# Altium project PMI_MotorDriver.PrjPCB
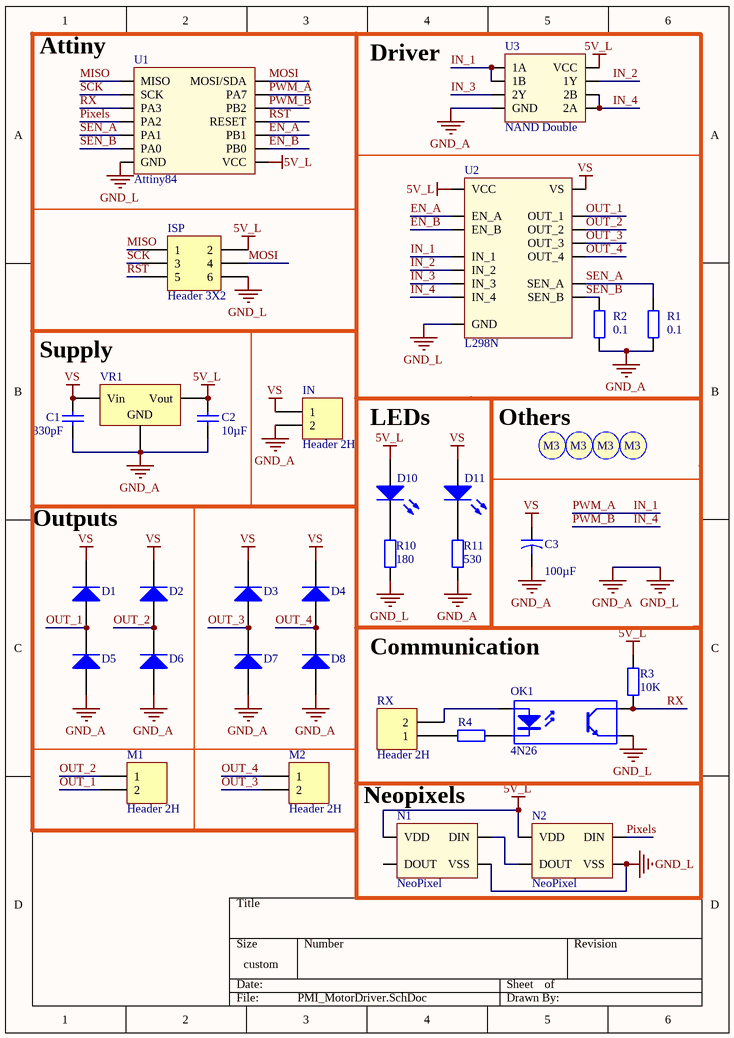
[diagram p0: PMI_MotorDriver.SchDoc]
1 sheet, 35 parts. Net scope: global (net labels, ports and power ports of the same name join across sheets).
Board file: PMI_MotorDriver.PcbDoc

## Sheet PMI_MotorDriver.SchDoc: PMI Motor Driver
size 136 x 193 mm; Date: 04/05/2019; DrawnBy: Damien DESCLAUX; Engineer: Damien DESCLAUX; Organization: Supaero Robotik Club; DocumentNumber: 1; Revision: V 1.0; CurrentTime: 11H00; CurrentDate: 04/05/2019; DocumentName: PMI_MotorDriver

### Parts
C1  value 330pF  [3.2X1.6X1.1]  (hidden comment: Cap)
C2  value 10µF  [3.2X1.6X1.1]  (hidden comment: Cap)
C3  value 100µF  [Condensateur]  (hidden comment: Cap2)
D1  GF1G-E3/5CA (710-2976)  [DO-214BA]  (value not drawn)
D2  Diode  [DO-214BA]  (value not drawn)
D3  Diode  [DO-214BA]  (value not drawn)
D4  Diode  [DO-214BA]  (value not drawn)
D5  Diode  [DO-214BA]  (value not drawn)
D6  Diode  [DO-214BA]  (value not drawn)
D7  Diode  [DO-214BA]  (value not drawn)
D8  Diode  [DO-214BA]  (value not drawn)
D10  LED2  [3.2X1.6X1.1]  (value not drawn)
D11  LED2  [3.2X1.6X1.1]  (value not drawn)
IN  Header 2H  [Molex SPOX 2x1H]
ISP  Header 3X2  [HDR2X3]
M1  Header 2H  [Molex SPOX 2x1H]
M2  Header 2H  [Molex SPOX 2x1H]
N1  NeoPixel  [Neopixel]
N2  NeoPixel  [Neopixel]
OK1  4N26  [4N26]
R1  value 0.1  [CRA2512]  (hidden comment: Res2)
R2  value 0.1  [CRA2512]  (hidden comment: Res2)
R3  value 10K  [3.2X1.6X1.1]  (hidden comment: Res2)
R4  Res2  [3.2X1.6X1.1]  (value not drawn)
R10  value 180  [3.2X1.6X1.1]  (hidden comment: Res2)
R11  value 530  [3.2X1.6X1.1]  (hidden comment: Res2)
RX  Header 2H  [Molex SPOX 2x1H]
S1  Screw M3  [Screw M3]  (value not drawn)
S2  Screw M3  [Screw M3]  (value not drawn)
S3  Screw M3  [Screw M3]  (value not drawn)
S4  Screw M3  [Screw M3]  (value not drawn)
U1  Attiny84  [Attiny84 SOIC]
U2  L298N  [L298N]
U3  NAND Double  [SOIC_8]
VR1  BA178M05FP-E2  [TO-252]  (value not drawn)

### Nets
5V_L: C2.2 D10.1(A) ISP.2 N1.4(VDD) N2.4(VDD) R3.2 U1.1(VCC) U2.9(VCC) U3.8(VCC) VR1.3(Vout)
GND_A: C1.1 C2.1 C3.2 D5.1(A) D6.1(A) D7.1(A) D8.1(A) IN.2 ISP.6 N1.2(VSS) N2.2(VSS) OK1.3(E) R1.1 R2.1 R10.2 R11.2 U1.14(GND) U2.8(GND) U3.4(GND) VR1.2(GND)  [also labelled GND_L]
VS: C1.2 C3.1 D1.2(K) D2.2(K) D3.2(K) D4.2(K) D11.1(A) IN.1 U2.4(VS) VR1.1(Vin)
EN_A: U1.3(PB1) U2.6(EN_A)
EN_B: U1.2(PB0) U2.11(EN_B)
IN_1: U1.6(PA7) U2.5(IN_1) U3.1(1A) U3.2(1B)  [also labelled PWM_A]
IN_2: U2.7(IN_2) U3.7(1Y)
IN_3: U2.10(IN_3) U3.3(2Y)
IN_4: U1.5(PB2) U2.12(IN_4) U3.5(2A) U3.6(2B)  [also labelled PWM_B]
MISO: ISP.1 U1.8(MISO)
MOSI: ISP.4 U1.7(MOSI/SDA)
OUT_1: D1.1(A) D5.2(K) M1.2 U2.2(OUT_1)
OUT_2: D2.1(A) D6.2(K) M1.1 U2.3(OUT_2)
OUT_3: D3.1(A) D7.2(K) M2.2 U2.13(OUT_3)
OUT_4: D4.1(A) D8.2(K) M2.1 U2.14(OUT_4)
Pixels: N2.3(DIN) U1.11(PA2)
RST: ISP.5 U1.4(RESET)
RX: OK1.4(C) R3.1 U1.10(PA3)
SCK: ISP.3 U1.9(SCK)
SEN_A: R1.2 U1.12(PA1) U2.1(SEN_A)
SEN_B: R2.2 U1.13(PA0) U2.15(SEN_B)
NetD10_2: D10.2(K) R10.1
NetD11_2: D11.2(K) R11.1
NetN1_3: N1.3(DIN) N2.1(DOUT)
NetOK1_1: OK1.1(A) RX.2
NetOK1_2: OK1.2(K) R4.2
NetR4_1: R4.1 RX.1

Not connected (* = marked no-connect by the designer): N1 1(DOUT)

### Notes on the sheet
- (near U1) Attiny
- Driver
- Supply
- LEDs
- Others
- Outputs
- Communication
- (near N1) Neopixels
- (in symbol Screw M3) M3

### Library data of the parts
C1 C2 = Cap: Capacitor; Published: 8-Jun-2000; LatestRevisionDate: 17-Jul-2002; LatestRevisionNote: Re-released for DXP Platform.; PackageReference: RAD-0.3; Publisher: Altium Limited; PackageDescription: Radial Cap, Thru-Hole; 2 Leads; 0.3 in Pin Spacing
C3 = Cap2: Capacitor; Published: 23-Sep-2002; PackageReference: CAPR5-4X5; Publisher: Altium Limited; PackageDescription: Capacitor; 2 Leads
D1-D8 = Diode: Default Diode; Published: 8-Jun-2000; LatestRevisionDate: 17-Jul-2002; LatestRevisionNote: Re-released for DXP Platform.; PackageVersion: Sep-1996; PackageReference: SMC; Publisher: Altium Limited; PackageDescription: DO-214-AB/SMC; 2 C-Bend Leads; Body 7.9 x 5.9 mm, inc. leads (LxW); Code_JEDEC: DO-214-AB
D10 D11 = LED2: Typical RED, GREEN, YELLOW, AMBER GaAs LED; Published: 8-Jun-2000; LatestRevisionDate: 17-Jul-2002; LatestRevisionNote: Re-released for DXP Platform.; PackageVersion: Feb-2002; PackageReference: 3.2X1.6X1.1; Publisher: Altium Limited; PackageDescription: SM LED; 2 Flat Leads
IN M1 M2 RX = Header 2H: Header, 2-Pin, Right Angle; LatestRevisionDate: 17-Jul-2002; LatestRevisionNote: Re-released for DXP Platform.; Publisher: Altium Limited
ISP = Header 3X2: Header, 3-Pin, Dual row; LatestRevisionDate: 17-Jul-2002; LatestRevisionNote: Re-released for DXP Platform.; Publisher: Altium Limited
N1 N2 = NeoPixel: pin to pad: 1>4 2>1 3>2 4>3
OK1 = Optoisolator1: 4-Pin Phototransistor Optocoupler; pin to pad: 3>4 4>5; Published: 24-Mar-1999; LatestRevisionDate: 04-Mar-2005; LatestRevisionNote: Sch pins 3 & 4 Swapped.; DatasheetVersion: Nov-2003; PackageReference: DIP-4; Publisher: Altium Limited
R1-R3 R10 R11 = Res2: Resistor; Published: 8-Jun-2000; LatestRevisionDate: 17-Jul-2002; LatestRevisionNote: Re-released for DXP Platform.; PackageReference: AXIAL-0.4; Publisher: Altium Limited; PackageDescription: Axial Device, Thru-Hole; 2 Leads; 0.4 in Pin Spacing
R4 = Res2: Resistor; Value: 1K; Published: 8-Jun-2000; LatestRevisionDate: 17-Jul-2002; LatestRevisionNote: Re-released for DXP Platform.; PackageReference: AXIAL-0.4; Publisher: Altium Limited; PackageDescription: Axial Device, Thru-Hole; 2 Leads; 0.4 in Pin Spacing
U2 = L298N: Motor Driver 2 outputs
VR1 = Volt Reg: Voltage Regulator; Published: 24-Mar-1999; LatestRevisionDate: 29-May-2009; LatestRevisionNote: IPC-7351 Footprint Added.; PackageReference: D2PAK; Publisher: Altium Limited; PackageDescription: 3-Pin Transistor Outline Package 2.54 mm Pitch, 15.1 mm Lead Span